# EAGLE design ControllerBase (EAGLE 7.1.0)
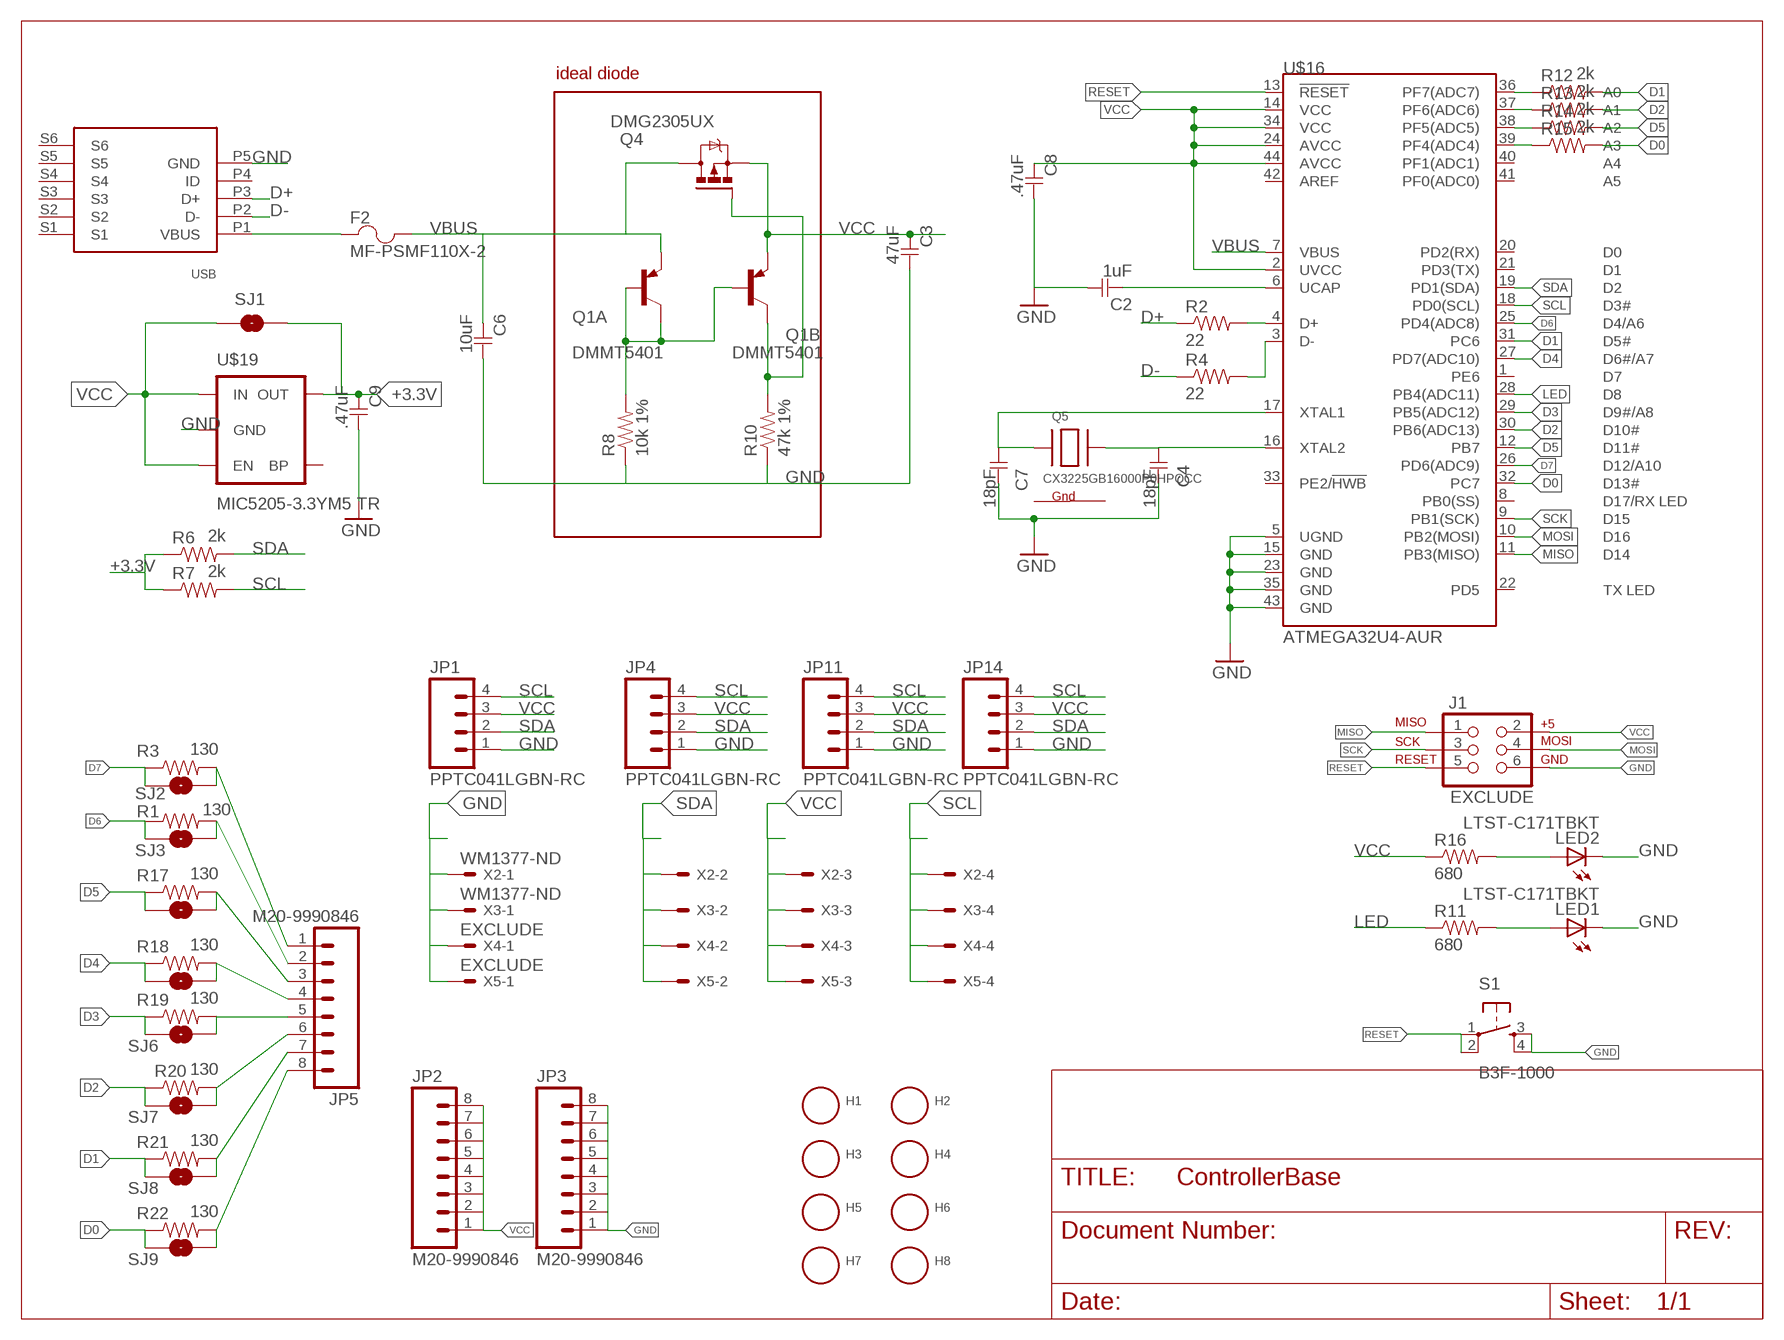
[diagram p0: schematic, sheet 1]

## Parts
C2  1uF  CAPACITOR  [0805]
C3  47uF  CAPACITOR  [0805]
C4  18pF  CAPACITOR  [0805]
C6  10uF  CAPACITOR  [0805]
C7  18pF  CAPACITOR  [0805]
C8  .47uF  CAPACITOR  [0805]
C9  .47uF  CAPACITOR  [0805]
F2  MF-PSMF110X-2  FUSE  [0805]
H1  EXCLUDE  HOLE#2  [HOLE-#2]
H2  EXCLUDE  HOLE#2  [HOLE-#2]
H3  EXCLUDE  HOLE#2  [HOLE-#2]
H4  EXCLUDE  HOLE#2  [HOLE-#2]
H5  EXCLUDE  HOLE#2  [HOLE-#2]
H6  EXCLUDE  HOLE#2  [HOLE-#2]
H7  EXCLUDE  HOLE#2  [HOLE-#2]
H8  EXCLUDE  HOLE#2  [HOLE-#2]
J1  EXCLUDE  AVR_SPI_PRG_62X3_LOCK  [2X3_LOCK]
JP1  PPTC041LGBN-RC  M04LOCK  [1X04_LOCK]
JP2  M20-9990846  M08NO_SILK  [1X08_NO_SILK]
JP3  M20-9990846  M08NO_SILK  [1X08_NO_SILK]
JP4  PPTC041LGBN-RC  M04LOCK  [1X04_LOCK]
JP5  M20-9990846  M08NO_SILK  [1X08_NO_SILK]
JP11  PPTC041LGBN-RC  M04LOCK  [1X04_LOCK]
JP14  PPTC041LGBN-RC  M04LOCK  [1X04_LOCK]
LED1  LTST-C171TBKT  LED-0805-BLUE  [0805-LED]
LED2  LTST-C171TBKT  LED-0805-BLUE  [0805-LED]
Q1  DMMT5401  TRANSISTOR-DUAL-PNP  [SOT-26]
Q4  DMG2305UX  IRLML5203  [MICRO3]
Q5  CX3225GB16000P0HPQCC  XTAL-4-3225  [NX3225]
R1  130  RESISTOR  [0805]
R2  22  RESISTOR  [0805]
R3  130  RESISTOR  [0805]
R4  22  RESISTOR  [0805]
R6  2k  RESISTOR  [0805]
R7  2k  RESISTOR  [0805]
R8  10k 1%  RESISTOR  [0805]
R10  47k 1%  RESISTOR  [0805]
R11  680  RESISTOR  [0805]
R12  2k  RESISTOR  [0805]
R13  2k  RESISTOR  [0805]
R14  2k  RESISTOR  [0805]
R15  2k  RESISTOR  [0805]
R16  680  RESISTOR  [0805]
R17  130  RESISTOR  [0805]
R18  130  RESISTOR  [0805]
R19  130  RESISTOR  [0805]
R20  130  RESISTOR  [0805]
R21  130  RESISTOR  [0805]
R22  130  RESISTOR  [0805]
S1  B3F-1000  TAC_SWITCHPTH  [TACTILE-PTH]
SJ1  EXCLUDE  SOLDERJUMPERNO  [SJ_2S-NO]
SJ2  EXCLUDE  SOLDERJUMPERNO  [SJ_2S-NO]
SJ3  EXCLUDE  SOLDERJUMPERNO  [SJ_2S-NO]
SJ4  EXCLUDE  SOLDERJUMPERNO  [SJ_2S-NO]
SJ5  EXCLUDE  SOLDERJUMPERNO  [SJ_2S-NO]
SJ6  EXCLUDE  SOLDERJUMPERNO  [SJ_2S-NO]
SJ7  EXCLUDE  SOLDERJUMPERNO  [SJ_2S-NO]
SJ8  EXCLUDE  SOLDERJUMPERNO  [SJ_2S-NO]
SJ9  EXCLUDE  SOLDERJUMPERNO  [SJ_2S-NO]
U$16  ATMEGA32U4-AUR  ATMEGA32U4TQFP  [SPARKFUN-DIGITALIC_TQFP44]
U$17  10118194-0001LF  USBFCI-MICROB  [USB-MICROB-FCI]
U$19  MIC5205-3.3YM5 TR  VREG-MIC5205-3.3V  [SOT23-5]
X2  WM1377-ND  C-GRID-04-15-91  [15-91-04]
X3  WM1377-ND  C-GRID-04-15-91  [15-91-04]
X4  EXCLUDE  C-GRID-04-15-91  [15-91-04]
X5  EXCLUDE  C-GRID-04-15-91  [15-91-04]

## Nets
+3.3V: C9.1 R6.1 R7.1 SJ1.2 U$19.5(OUT)
D0: R15.2 R22.1 SJ9.1 U$16.32(PC7)
D1: R12.2 R21.1 SJ8.1 U$16.31(PC6)
D2: R13.2 R20.1 SJ7.1 U$16.30(PB6(ADC13))
D3: R19.1 SJ6.1 U$16.29(PB5(ADC12))
D4: R18.1 SJ5.1 U$16.27(PD7(ADC10))
D5: R14.2 R17.1 SJ4.1 U$16.12(PB7)
D6: R1.1 SJ3.1 U$16.25(PD4(ADC8))
D7: R3.1 SJ2.1 U$16.26(PD6(ADC9))
D+: R2.1 U$17.P3(D+)
D-: R4.1 U$17.P2(D-)
GND: C2.2 C3.2 C4.2 C6.2 C7.2 C8.2 C9.2 J1.6 JP1.1 JP3.1 JP3.2 JP3.3 JP3.4 JP3.5 JP3.6 JP3.7 JP3.8 JP4.1 JP11.1 JP14.1 LED1.C LED2.C R8.1 R10.1 S1.3 S1.4 U$16.5(UGND) U$16.15(GND) U$16.23(GND) U$16.35(GND) U$16.43(GND) U$17.P5(GND) U$19.2(GND) X2.1 X3.1 X4.1 X5.1
LED: R11.1 U$16.28(PB4(ADC11))
MISO: J1.1 U$16.11(PB3(MISO))
MOSI: J1.4 U$16.10(PB2(MOSI))
N$3: JP5.2 R1.2 SJ3.2
N$4: JP5.1 R3.2 SJ2.2
N$22: C2.1 U$16.6(UCAP)
N$23: R2.2 U$16.4(D+)
N$24: R4.2 U$16.3(D-)
N$25: Q1.1(A:C) Q1.2(A:B) Q1.3(B:B) R8.2
N$26: Q1.4(B:C) Q4.1(G) R10.2
N$27: F2.1 U$17.P1(VBUS)
N$28: LED1.A R11.2
N$29: C4.1 Q5.3(X2) U$16.16(XTAL2)
N$30: R15.1 U$16.39(PF4(ADC4))
N$31: R14.1 U$16.38(PF5(ADC5))
N$32: R13.1 U$16.37(PF6(ADC6))
N$33: R12.1 U$16.36(PF7(ADC7))
N$34: LED2.A R16.2
N$35: C7.1 Q5.1(X1) U$16.17(XTAL1)
N$36: JP5.3 R17.2 SJ4.2
N$37: JP5.4 R18.2 SJ5.2
N$38: JP5.5 R19.2 SJ6.2
N$39: JP5.6 R20.2 SJ7.2
N$40: JP5.7 R21.2 SJ8.2
N$41: JP5.8 R22.2 SJ9.2
RESET: J1.5 S1.1 S1.2 U$16.13(!RESET)
SCK: J1.3 U$16.9(PB1(SCK))
SCL: JP1.4 JP4.4 JP11.4 JP14.4 R7.2 U$16.18(PD0(SCL)) X2.4 X3.4 X4.4 X5.4
SDA: JP1.2 JP4.2 JP11.2 JP14.2 R6.2 U$16.19(PD1(SDA)) X2.2 X3.2 X4.2 X5.2
VBUS: C6.1 F2.2 Q1.6(A:E) Q4.3(D) U$16.7(VBUS)
VCC: C3.1 C8.1 J1.2 JP1.3 JP2.1 JP2.2 JP2.3 JP2.4 JP2.5 JP2.6 JP2.7 JP2.8 JP4.3 JP11.3 JP14.3 Q1.5(B:E) Q4.2(S) R16.1 SJ1.1 U$16.2(UVCC) U$16.14(VCC) U$16.24(AVCC) U$16.34(VCC) U$16.44(AVCC) U$19.1(IN) U$19.3(EN) X2.3 X3.3 X4.3 X5.3
Unconnected: H1.P$1(HOLE) H2.P$1(HOLE) H3.P$1(HOLE) H4.P$1(HOLE) H5.P$1(HOLE) H6.P$1(HOLE) H7.P$1(HOLE) H8.P$1(HOLE) U$16.1(PE6) U$16.8(PB0(SS)) U$16.20(PD2(RX)) U$16.21(PD3(TX)) U$16.22(PD5) U$16.33(PE2/!HWB) U$16.40(PF1(ADC1)) U$16.41(PF0(ADC0)) U$16.42(AREF) U$17.P4(ID) U$17.S1 U$17.S2 U$17.S3 U$17.S4 U$17.S5 U$17.S6 U$19.4(BP)

## Notes on the sheet
- ideal diode

## Power pins joined to a net without a drawn wire
G1: Q5.4(G1)
G2: Q5.2(G2)

## Library data of the parts
C2-C4 C6-C9 = Modulo:CAPACITOR: Capacitor
F2 = Modulo:FUSE
H1-H8 = Modulo:HOLE; NOBOM: 1
J1 = SparkFun-Connectors:AVR_SPI_PRG_6: AVR ISP 6 Pin This is the reduced ISP connector for AVR programming. Common on Arduino. This footprint will take up less PCB space and can be used with a 10-pin to 6-pin adapter such as SKU: BOB-08508
JP1 JP4 JP11 JP14 = SparkFun-Connectors:M04: Header 4 Standard 4-pin 0.1" header. Use with straight break away headers (SKU : PRT-00116), right angle break away headers (PRT-00553), swiss pins (PRT-00743), machine pins (PRT-00117), and female headers (PRT-00115). Molex polarized connector foot print use with SKU : PRT-08231 with associated crimp pins and housings. 1MM SMD Version SKU: PRT-10208
JP2 JP3 JP5 = SparkFun-Connectors:M08: Header 8 Standard 8-pin 0.1" header. Use with straight break away headers (SKU : PRT-00116), right angle break away headers (PRT-00553), swiss pins (PRT-00743), machine pins (PRT-00117), and female headers (PRT-00115).
LED1 LED2 = Modulo:LED: LED
Q1 = IntegerLabs:TRANSISTOR-DUAL-PNP: PNP Transistor
Q4 = transistor-power:IRLML5203: HEXFET P-Channel Power MOSFET
Q5 = adafruit:XTAL-4: Classic 4-pin 3.2 x 2.5mm crystal
R1-R4 R6-R8 R10-R22 = Modulo:RESISTOR: Resistor Basic schematic elements and footprints for 0603, 1206, and PTH resistors.
S1 = SparkFun-Electromechanical:TAC_SWITCH: Momentary Switch Button commonly used for reset or general input. Spark Fun Electronics SKU : COM-00097 SMT- SWCH-08247
SJ1-SJ9 = SparkFun-Passives:SOLDERJUMPER: Solder Jumper Standard SMD solder jumper. Used to automate production. Two varients : Normally Open and Normally Closed are the same, but have different paste layers. NC will have a large amount of paste and should jumper during reflow.; NOBOM: 1
U$16 = SparkFun-DigitalIC:ATMEGA32U4: Atmel 44-pin 8-bit Microcontroller with 32KBytes of ISP Flash and USB Controller ----- Please use the QFN-44-NOPAD_1:1 package for the footprint of all boards using a 32U4. Route traces directly away from the pads as much as possible.; PROD_ID: IC-11161
U$17 = IntegerLabs:USB
U$19 = Modulo:VREG-MIC5205: V_REG MIC5219 Standard 3.3V and 5V 150mA LDO voltage regulator in SOT-23 layout. Micrel part MIC5205. BP (by-pass) pin is used to lower output noise with 470pF cap, may be left open.
X2-X5 = con-molex:C-GRID-04: CONNECTOR wire to board 2.54 mm (0.100") pitch header; OC_FARNELL: unknown; OC_NEWARK: unknown

## Board
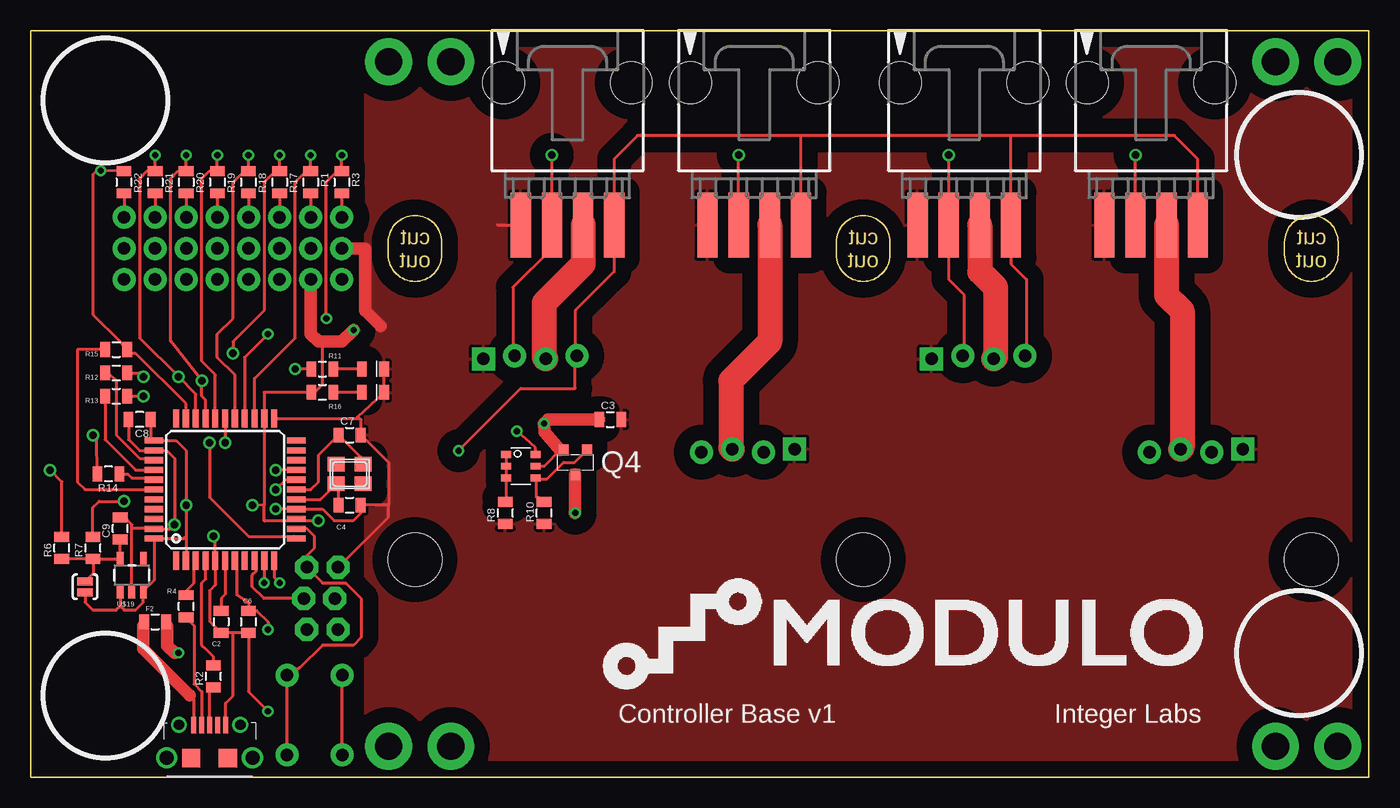
[diagram p1: board, top side]
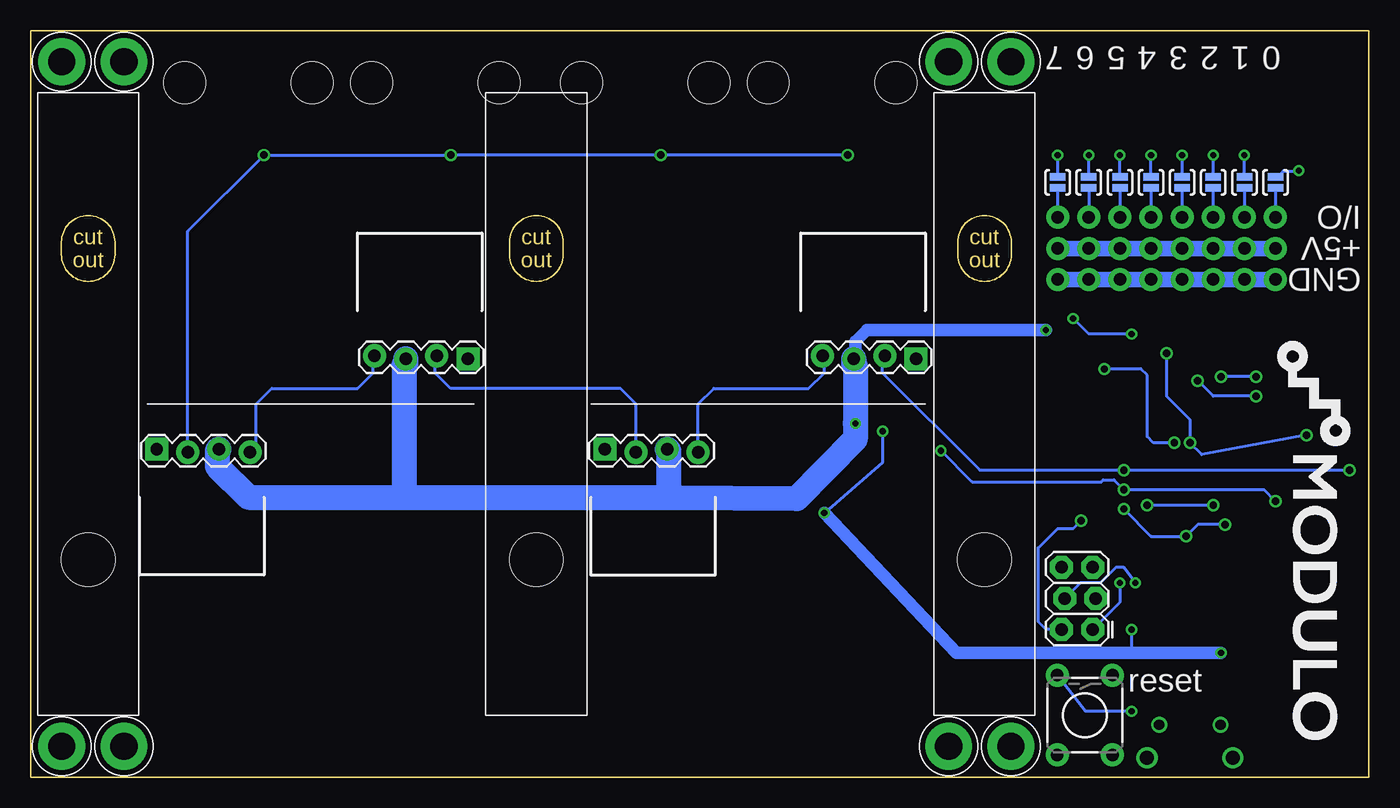
[diagram p2: board, bottom side, seen from below]

Size 109.22 x 60.96 mm. Coordinates in mm from the lower left corner, seen from the top.
Outline: 109.22,0 109.22,60.96 0,60.96 0,0 109.22,0
Copper layers (1*16): Top 0.0178mm / dielectric 59mil / Bottom 0.0178mm
Design rules "SSC-EAGLE-2Lyr_v1.0.0.3 *": minimum track width 6mil, minimum drill 14mil, track to track 6mil, track to pad 6mil, pad to pad 6mil, via to via 6mil, smd to smd 6mil, copper to edge 20mil, drill to drill 16mil, minimum pad ring 8mil, minimum via ring 8mil, stop-mask expansion 3mil, vias tented up to drill 25mil, thermal gap 10mil

### Footprints (pad centres in the part's own frame; a part is rotated, then mirrored left to right if it is on the bottom)
0805 = smd 0.8 x 1.2: 1 -0.9,0; 2 0.9,0
HOLE-#2 = drill 2.223 pad 3.81: P$1 0,0
2X3_LOCK = drill 1.016 pad 1.88 octagon: 1 0,0; 2 0,2.54; 3 2.54,-0.254; 4 2.54,2.286; 5 5.08,0; 6 5.08,2.54
1X04_LOCK = drill 1.016 pad 1.88 square: 1 0,0.127 | drill 1.016 pad 1.88: 2 2.54,-0.127; 3 5.08,0.127; 4 7.62,-0.127
1X08_NO_SILK = drill 1.016 pad 1.88: 1 0,0; 2 2.54,0; 3 5.08,0; 4 7.62,0; 5 10.16,0; 6 12.7,0; 7 15.24,0; 8 17.78,0
0805-LED = smd 1.2 x 0.8: A 0,-0.9; C 0,0.9
SOT-26 = smd 0.55 x 0.8: 1 -0.95,-1.2; 2 0,-1.2; 3 0.95,-1.2; 4 0.95,1.2; 5 0,1.2; 6 -0.95,1.2
MICRO3 = smd 0.8 x 0.9: 1 -0.95,-1; 2 0.95,-1; 3 0,1
NX3225 = smd 1.4 x 1.2: 1 -1.1,-0.8; 2 1.1,-0.8; 3 1.1,0.8; 4 -1.1,0.8
TACTILE-PTH = drill 1.016 pad 1.88: 1 -3.251,2.261; 2 3.251,2.261; 3 -3.251,-2.261; 4 3.251,-2.261
SJ_2S-NO = smd 0.635 x 1.27: 1 -0.45,0; 2 0.45,0
CARD-GUIDE-2" = hole 4.369: 0,-12.7
SPARKFUN-DIGITALIC_TQFP44 = smd 1.5 x 0.5: 1 -5.8,4; 2 -5.8,3.2; 3 -5.8,2.4; 4 -5.8,1.6; 5 -5.8,0.8; 6 -5.8,0; 7 -5.8,-0.8; 8 -5.8,-1.6; 9 -5.8,-2.4; 10 -5.8,-3.2; 11 -5.8,-4; 23 5.8,-4; 24 5.8,-3.2; 25 5.8,-2.4; 26 5.8,-1.6; 27 5.8,-0.8; 28 5.8,0; 29 5.8,0.8; 30 5.8,1.6; 31 5.8,2.4; 32 5.8,3.2; 33 5.8,4 | smd 0.5 x 1.5: 12 -4,-5.8; 13 -3.2,-5.8; 14 -2.4,-5.8; 15 -1.6,-5.8; 16 -0.8,-5.8; 17 0,-5.8; 18 0.8,-5.8; 19 1.6,-5.8; 20 2.4,-5.8; 21 3.2,-5.8; 22 4,-5.8; 34 4,5.8; 35 3.2,5.8; 36 2.4,5.8; 37 1.6,5.8; 38 0.8,5.8; 39 0,5.8; 40 -0.8,5.8; 41 -1.6,5.8; 42 -2.4,5.8; 43 -3.2,5.8; 44 -4,5.8
USB-MICROB-FCI = smd 0.4 x 1.35: P1 -1.3,2.7; P2 -0.65,2.7; P3 0,2.7; P4 0.65,2.7; P5 1.3,2.7 | drill 0.85: S1 -2.5,2.7; S2 2.5,2.7 | drill 1.15: S3 -3.5,0; S6 3.5,0 | smd 1.5 x 1.5: S4 -1.5,0; S5 1.5,0
SOT23-5 = smd 0.55 x 1.2: 1 -0.95,-1.3; 2 0,-1.3; 3 0.95,-1.3; 4 0.95,1.3; 5 -0.95,1.3
15-91-04 = smd 1.651 x 5.334: 1 -3.81,-10.795; 2 -1.27,-10.795; 3 1.27,-10.795; 4 3.81,-10.795 | hole 3.404: -5.207,0.838; 5.207,0.838

### Placement (x,y rotation side)
C2  15.56,12.7 270 top
C3  47.31,29.21 0 top
C4  26.04,22.23 0 top
C6  17.78,12.7 270 top
C7  26.04,27.94 0 top
C8  8.89,29.21 180 top
C9  7.3,20.32 90 top
F2  10.16,12.7 0 top
H1  106.68,2.54 0 bottom
H2  106.68,58.42 0 bottom
H3  34.29,58.42 0 bottom
H4  29.21,58.42 0 bottom
H5  34.29,2.54 0 bottom
H6  101.6,58.42 0 bottom
H7  101.6,2.54 0 bottom
H8  29.21,2.54 0 bottom
J1  22.54,12.06 90 bottom
JP1  98.93,26.67 0 bottom
JP2  7.62,40.64 180 bottom
JP3  7.62,43.18 180 bottom
JP4  73.53,34.29 180 bottom
JP5  25.4,45.72 0 bottom
JP11  62.36,26.67 0 bottom
JP14  36.96,34.29 180 bottom
LED1  27.94,33.34 270 top
LED2  27.94,31.43 270 top
Q1  40.01,25.4 270 top
Q4  44.45,25.72 180 top
Q5  26.04,24.77 180 top
R1  22.86,48.58 270 top
R2  14.92,8.26 90 top
R3  25.4,48.58 270 top
R4  12.7,13.97 90 top
R6  2.54,18.73 90 top
R7  5.08,18.73 90 top
R8  38.73,21.59 90 top
R10  41.91,21.59 90 top
R11  23.81,33.34 0 top
R12  6.99,33.02 0 top
R13  6.99,31.11 0 top
R14  6.35,24.77 180 top
R15  6.99,34.92 0 top
R16  23.81,31.43 0 top
R17  20.32,48.58 270 top
R18  17.78,48.58 270 top
R19  15.24,48.58 270 top
R20  12.7,48.58 270 top
R21  10.16,48.58 270 top
R22  7.62,48.58 270 top
S1  23.18,5.08 270 bottom
SJ1  4.45,15.56 90 top
SJ2  25.4,48.58 270 bottom
SJ3  22.86,48.58 270 bottom
SJ4  20.32,48.58 270 bottom
SJ5  17.78,48.58 270 bottom
SJ6  15.24,48.58 270 bottom
SJ7  12.7,48.58 270 bottom
SJ8  10.16,48.58 270 bottom
SJ9  7.62,48.58 270 bottom
U$1  [LOGO_WITH_TEXT_0.25_INCH]  7.62,35.88 270 bottom
U$2  [LOGO_WITH_TEXT_0.5]  46.35,6.99 0 top
U$3  [CARD-GUIDE-2"]  104.52,30.48 0 bottom
U$4  [CARD-GUIDE-2"]  67.94,30.48 0 bottom
U$5  [CARD-GUIDE-2"]  31.37,30.48 0 bottom
U$16  15.88,23.5 90 top
U$17  14.61,1.59 0 top
U$19  8.26,16.51 0 top
X2  76.2,55.88 0 top
X3  59.05,55.88 0 top
X4  43.81,55.88 0 top
X5  91.44,55.88 0 top

### Tracks (layer width: path | path; a pad name or v marks a point on that pad's centre or on a via)
+3.3V
  Top 0.254: C9.1 7.3,19.73 U$19.5 5.1,17.81 | 5.1,17.81 R7.1 R6.1 | 5.1,17.81 5.1,16.66 SJ1.2
D0  (via drill 0.51 pad 0.25)
  Top 0.254: U$16.32 12.68,30.5 8.57,34.61 8.2,34.61 R15.2 7.3,35.56 5.08,37.78 5.08,49.21 5.4,49.53 v5.71,49.52 R22.1
  Bottom 0.254: SJ9.1 7.46,49.03 7,49.49 5.75,49.49 v5.71,49.52
D1  (via drill 0.51 pad 0.25, 0.6)
  Top 0.254: U$16.31 13.47,31.29 v12.06,32.7 8.89,35.88 8.89,48.9 9.47,49.48 R21.1 v10.16,50.8 | R12.2 8.89,33.02 v9.21,32.7
  Bottom 0.254: v9.21,32.7 v12.06,32.7 | SJ8.1 v10.16,50.8
D2  (via drill 0.51 pad 0.25, 0.6)
  Top 0.254: U$16.30 14.28,30.81 13.97,31.11 v13.97,32.38 11.43,35.61 11.43,48.9 12.01,49.48 R20.1 v12.7,50.8 | R13.2 v9.21,31.11
  Bottom 0.254: v9.21,31.11 12.7,31.11 v13.97,32.38 | SJ7.1 v12.7,50.8
D3  (via drill 0.51 pad 0.25)
  Top 0.254: U$16.29 15.07,32.87 13.97,33.97 13.97,48.9 14.55,49.48 R19.1 v15.24,50.8
  Bottom 0.254: SJ6.1 v15.24,50.8
D4  (via drill 0.51 pad 0.25)
  Top 0.254: U$16.27 16.68,32.85 15.24,34.29 15.24,36.2 16.51,37.47 16.51,48.58 17.41,49.48 R18.1 v17.78,50.8
  Bottom 0.254: SJ5.1 v17.78,50.8
D5  (via drill 0.51 pad 0.25, 0.6)
  Top 0.254: v16.51,34.61 16.51,35.56 19.05,38.1 19.05,48.58 19.95,49.48 R17.1 v20.32,50.8 | v14.61,27.3 14.61,22.86 17.78,19.68 21.48,19.68 U$16.12 | R14.2 5.4,27.62 5.13,27.89 5.13,27.99 v5.08,27.94
  Bottom 0.254: v16.51,34.61 16.51,31.11 14.61,29.21 v14.61,27.3 13.65,26.35 v5.08,27.94 | SJ4.1 v20.32,50.8
D6  (via drill 0.51 pad 0.25)
  Top 0.254: U$16.25 18.27,32.56 21.59,35.88 21.59,48.58 22.49,49.48 R1.1 v22.86,50.8
  Bottom 0.254: SJ3.1 v22.86,50.8
D7  (via drill 0.51 pad 0.25)
  Top 0.254: U$16.26 17.46,29.31 17.46,34.29 v19.37,36.2 | v24.13,37.47 24.13,48.58 25.03,49.48 R3.1 v25.4,50.8
  Bottom 0.254: v19.37,36.2 22.86,36.2 v24.13,37.47 | SJ2.1 v25.4,50.8
D+
  Top 0.254: U$17.P3 14.61,7.04 R2.1
D-
  Top 0.254: R4.1 12.65,12.96 12.7,13.02 13.34,12.38 13.34,7.62 13.97,6.99 13.97,4.94 U$17.P2
GND  (via drill 0.51 pad 0.25, 0.6)
  Top 0.254: 38.1,45.09 X4.1 | 26.99,27.94 29.21,25.72 29.21,22.23 | 29.21,22.23 C4.2 26.99,22.17 26.99,21.59 26.35,20.95 24.77,20.95 23.82,21.89 U$16.15 20.02,21.89 v20,21.91 | C7.2 26.99,27.94 | 26.99,27.94 26.99,29.21 | 26.99,29.21 26.67,29.43 LED2.C LED1.C 29.17,33.16 | v14.92,19.68 15.07,19.53 U$16.5 15.07,15.71 14.61,15.24 14.61,12.75 C2.2 | U$16.23 26.75,29.3 26.99,29.21 | U$19.2 8.26,20.32 | C8.2 7.99,27.57 8.89,26.67 10.05,26.67 U$16.35 11.09,26.7 11.75,26.04 v11.75,20.64 11.4,20.3 U$16.43 10.05,20.32 8.26,20.32 | C2.2 C6.2 17.78,6.99 v19.37,5.4 | J1.6 29.21,21.27 29.21,22.23 | S1.4 S1.3 | 7.25,21.22 C9.2 7.04,21.27 7.94,20.95 8.26,20.64 8.26,20.32 | U$17.P5 15.9,6.06 16.51,6.67 16.54,11.83 C2.2
  Top 1.016: JP3.8 27.3,43.18 27.3,38.1 28.57,36.83
  Bottom 0.254: v11.75,20.64 13.97,20.64 v14.92,19.68 17.78,19.68 v20,21.91 | v19.37,5.4 23.14,5.4 S1.3
  Bottom 1.27: JP3.8 JP3.7 JP3.6 JP3.5 JP3.4 JP3.3 JP3.2 JP3.1
  pour Top (isolate 1.27): 109.22,0 109.22,60.96 27.3,60.96 27.3,0
LED  (via drill 0.6)
  Top 0.254: U$16.28 v15.88,27.3 | R11.1 v21.59,33.34
  Bottom 0.254: v15.88,27.3 17.59,27.3 18.1,27.81 18.1,32.83 18.61,33.34 v21.59,33.34
MISO  (via drill 0.51 pad 0.25)
  Top 0.254: U$16.11 19.88,16.32 v20.32,15.88
  Bottom 0.254: v20.32,15.88 20.32,14.29 J1.1
MOSI  (via drill 0.51 pad 0.25)
  Top 0.254: U$16.10 19.07,15.9 v19.05,15.88
  Bottom 0.254: v19.05,15.88 20,17.14 20.64,17.14 21.91,15.88 23.56,15.88 J1.4
N$3
  Top 0.254: R1.2 JP5.2
  Bottom 0.254: SJ3.2 JP5.2
N$4
  Top 0.254: R3.2 JP5.1
  Bottom 0.254: JP5.1 SJ2.2
N$22
  Top 0.254: U$16.6 15.88,14.92 15.56,14.61 C2.1
N$23
  Top 0.254: R2.2 14.92,9.84 14.29,10.48 13.97,10.79 13.97,15.88 14.29,16.19 14.29,17.68 U$16.4
N$24
  Top 0.254: R4.2 12.7,15.24 13.34,15.88 13.34,17.55 U$16.3
N$25
  Top 0.254: Q1.1 Q1.2 Q1.3 38.79,22.55 R8.2
N$26
  Top 0.254: R10.2 41.54,22.81 41.27,22.86 41.27,24.38 | 41.27,24.38 Q1.4 | 41.27,24.38 42.16,24.38 43.5,25.72 44.4,25.72 Q4.1
N$27
  Top 0.254: U$17.P1 13.34,4.76 13.34,6.35 12.99,6.7 | 9.21,12.38 9.26,12.44 F2.1
  Top 1.016: 12.99,6.7 9.21,10.48 9.21,12.38
N$28
  Top 0.254: LED1.A R11.2
N$29
  Top 0.254: U$16.16 23.66,22.7 Q5.3 25.14,23.77 C4.1
N$30
  Top 0.254: R15.1 3.81,34.92 3.81,24.13 4.45,23.5 U$16.39
N$31
  Top 0.254: R14.1 7.94,24.77 8.26,24.45 9.92,24.45 U$16.38
N$32
  Top 0.254: R13.1 6.08,27.57 8.57,25.08 10.06,25.08 U$16.37
N$33
  Top 0.254: R12.1 6.35,33.02 6.99,32.38 6.99,27.94 8.89,26.04 9.94,26.04 U$16.36
N$34
  Top 0.254: LED2.A R16.2
N$35
  Top 0.254: U$16.17 22.86,23.5 23.5,24.13 23.5,26.3 C7.1 27.14,25.94 Q5.1
N$36
  Top 0.254: R17.2 JP5.3
  Bottom 0.254: SJ4.2 JP5.3
N$37
  Top 0.254: R18.2 JP5.4
  Bottom 0.254: SJ5.2 JP5.4
N$38
  Top 0.254: R19.2 JP5.5
  Bottom 0.254: JP5.5 SJ6.2
N$39
  Top 0.254: R20.2 JP5.6
  Bottom 0.254: JP5.6 SJ7.2
N$40
  Top 0.254: R21.2 JP5.7
  Bottom 0.254: SJ8.2 JP5.7
N$41
  Top 0.254: R22.2 JP5.8
  Bottom 0.254: SJ9.2 JP5.8
RESET
  Top 0.254: U$16.13 21.7,20.32 22.54,20.32 23.18,19.68 23.18,18.73 22.54,18.1 J1.5 23.81,15.88 25.72,15.88 26.99,14.61 26.99,11.43 26.35,10.79 23.81,10.79 21.98,8.97 S1.1 S1.2
SCK
  Top 0.254: J1.3 19.05,14.61 18.1,15.56 18.1,16.51 18.41,16.83 18.41,17.55 U$16.9
SCL  (via drill 0.51 pad 0.25, 0.6)
  Top 0.254: JP4.4 81.28,34.54 81.28,40.64 80.01,41.91 X2.4 80.01,52.39 | X5.4 95.25,50.48 93.34,52.39 80.01,52.39 | 80.01,52.39 62.87,52.39 | 62.87,52.39 49.53,52.39 47.62,50.48 X4.4 47.62,41.27 44.45,38.1 44.45,34.54 JP14.4 44.45,34.29 44.45,31.75 40.01,31.75 v34.92,26.67 | X3.4 62.87,52.39 | U$16.18 20.8,24.3 v20,23.5 | R7.2 5.08,22.04 5.59,22.54 v7.62,22.54
  Bottom 0.254: JP1.4 90.93,26.54 90.81,26.67 90.81,30.48 89.53,31.75 82.55,31.75 81.28,33.02 81.28,34.29 JP4.4 | JP11.4 54.74,30.48 53.47,31.75 45.72,31.75 44.45,33.02 44.45,34.29 44.7,34.29 JP14.4 44.45,34.54 | v7.62,22.54 8.57,23.5 v20,23.5 20.8,24.3 U$16.18 21.84,24.13 32.38,24.13 v34.92,26.67
SDA  (via drill 0.6)
  Top 0.254: v74.93,50.8 X2.2 74.93,40.64 76.2,39.37 76.2,34.92 76.07,34.8 JP4.2 | X5.2 v90.17,50.8 | X3.2 v57.78,50.8 | v42.55,50.8 X4.2 42.55,43.18 39.37,40.01 39.37,34.54 JP14.2 | U$16.19 20.02,25.09 v20,25.08 | R6.2 2.54,24.13 v1.59,25.08
  Bottom 0.254: v42.55,50.8 v57.78,50.8 v74.93,50.8 v90.17,50.8 96.39,44.58 JP1.2 | JP11.2 59.82,30.48 61.09,31.75 74.93,31.75 76.2,33.02 76.2,34.29 JP4.2 | v1.59,25.08 v20,25.08 31.75,25.08 39.69,33.02 39.69,34.23 JP14.2 39.37,34.54 39.37,34.92
VBUS  (via drill 0.51 pad 0.25)
  Top 0.254: U$16.7 16.83,17.54 16.83,14.92 17.83,14.23 C6.1 18.47,13.6 19.37,12.7 v19.37,12.06 | F2.2 11.16,12.33 | 11.75,10.16 v12.06,10.16 | Q1.6 41.2,26.92 v39.69,28.26
  Top 1.016: 11.16,12.33 11.16,10.74 11.75,10.16 | v44.45,21.59 Q4.3
  Bottom 0.254: v19.37,12.06 19.37,10.48 19.05,10.16 | v39.69,28.26 39.69,25.72 v44.45,21.59
  Bottom 1.016: v12.06,10.16 19.05,10.16 33.66,10.16 v44.45,21.59
VCC  (via drill 0.51 pad 0.25, 0.6)
  Top 0.254: 19.07,22.2 U$16.24 19.05,29.32 19.05,31.43 R16.1 23.18,31.43 23.81,32.07 23.81,35.24 23.5,35.56 | 21.54,20.95 19.05,20.95 19.07,20.93 19.07,22.2 | 21.54,20.95 U$16.14 | C8.1 9.79,27.78 U$16.34 11.88,27.5 12.7,26.67 v12.7,22.23 12.7,19.68 | 12.7,19.68 12.7,17.72 U$16.2 | 12.7,19.68 12.51,19.5 U$16.44 10.07,16.08 U$19.3 9.21,14.29 8.57,13.65 7.62,13.65 7.3,13.97 | 19.07,22.2 v18.1,22.23 | U$19.1 7.3,13.97 | SJ1.1 4.45,14.29 5.08,13.65 6.99,13.65 7.3,13.97 | 21.54,20.95 v23.5,20.95 | Q4.2 43.23,26.72 41.91,25.4 Q1.5
  Top 1.016: JP2.7 22.86,36.2 23.5,35.56 25.4,35.56 v26.35,36.51 | 43.23,26.72 41.96,28.21 v41.91,28.89 42.23,29.21 C3.1
  Top 2.032: X2.3 77.47,41.27 78.74,40.01 78.74,34.29 JP4.3 | X5.3 92.71,39.37 93.98,38.1 93.98,26.92 JP1.3 | X3.3 60.33,35.56 57.15,32.38 57.15,26.92 JP11.3 | X4.3 45.09,41.91 41.91,38.73 41.91,34.29 JP14.3
  Bottom 0.254: v18.1,22.23 v12.7,22.23 | v23.5,20.95 24.13,20.32 25.4,20.32 26.99,18.73 26.99,12.7 26.35,12.06 J1.2
  Bottom 1.016: v26.35,36.51 40.96,36.51 41.91,35.56 41.91,34.29 JP14.3
  Bottom 1.27: JP2.8 JP2.7 JP2.6 JP2.5 JP2.4 JP2.3 JP2.2 JP2.1
  Bottom 2.032: JP1.3 93.98,26.67 93.98,25.4 91.44,22.86 78.74,22.86 | 78.74,22.86 57.15,22.86 | 57.15,22.86 46.69,22.75 41.91,27.62 v41.91,28.89 41.91,33.66 42.04,33.78 JP14.3 | JP4.3 78.61,33.78 78.74,33.66 78.74,22.86 | JP11.3 57.15,26.67 57.15,22.86

### Text on the board
tPlace: Controller Base v1 | Integer Labs
bPlace: 0 | 1 | 2 | 3 | 4 | 5 | 6 | 7 | I/O | +5V | GND | reset